# EasyEDA Pro project 赛博沙漏彩砂版二代（完全开源）.eprj, board YW_002C_RGB
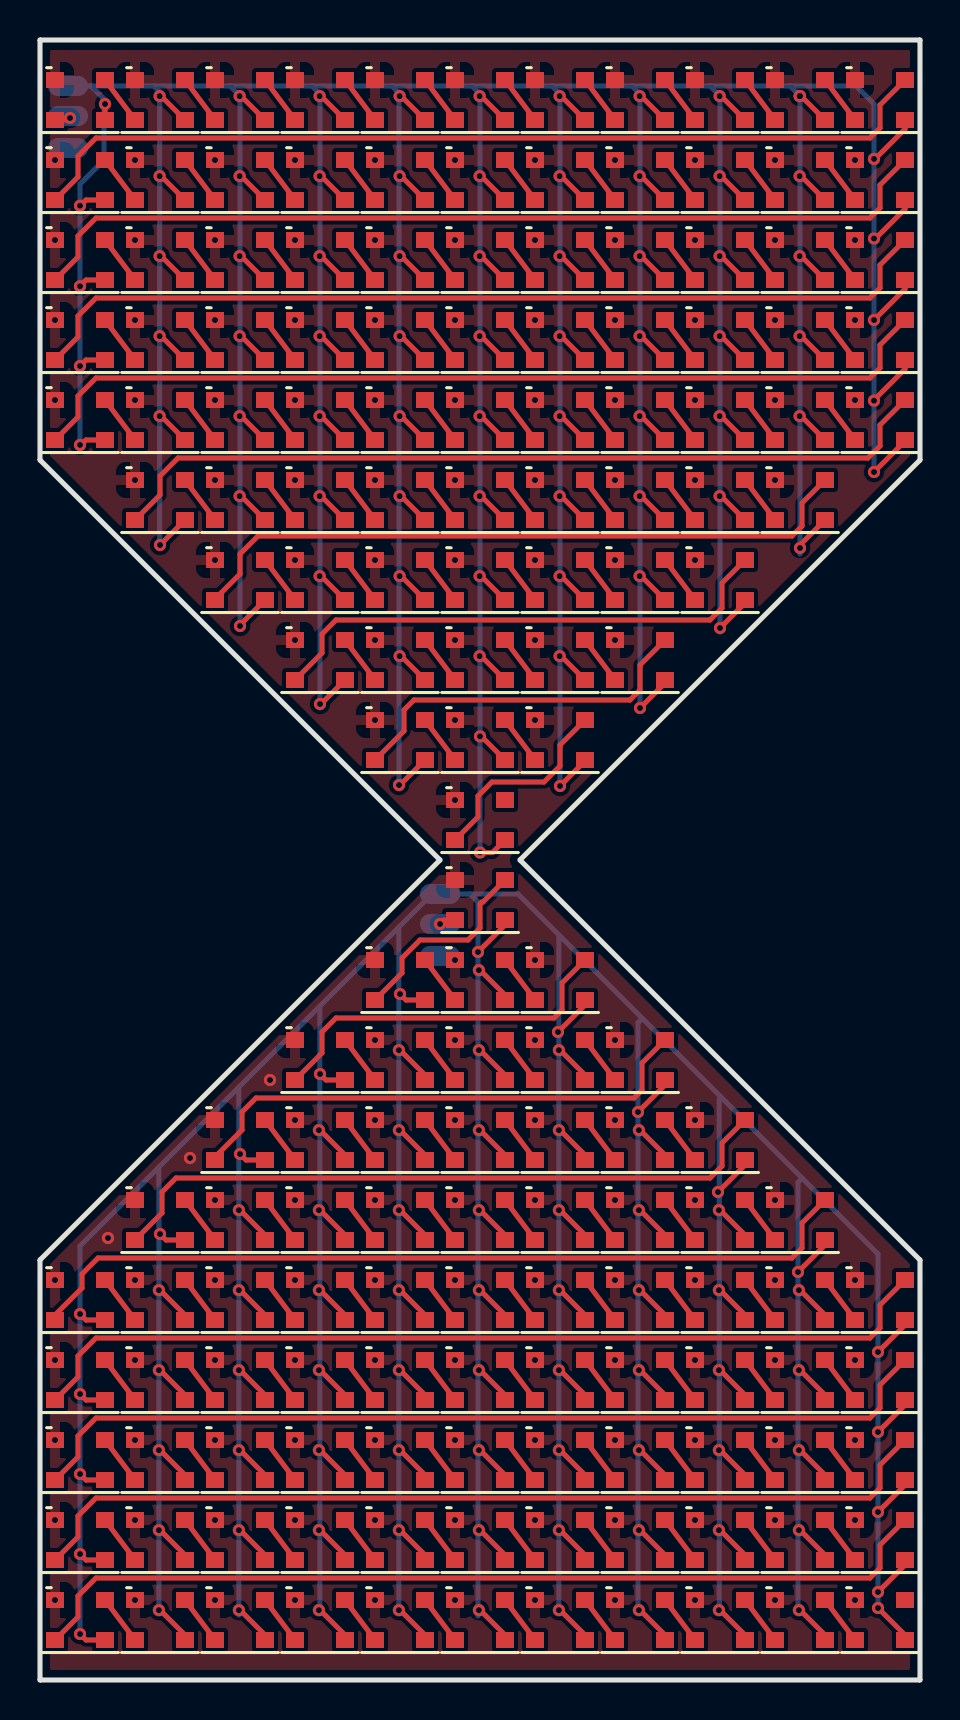
[diagram p4: board, top side]
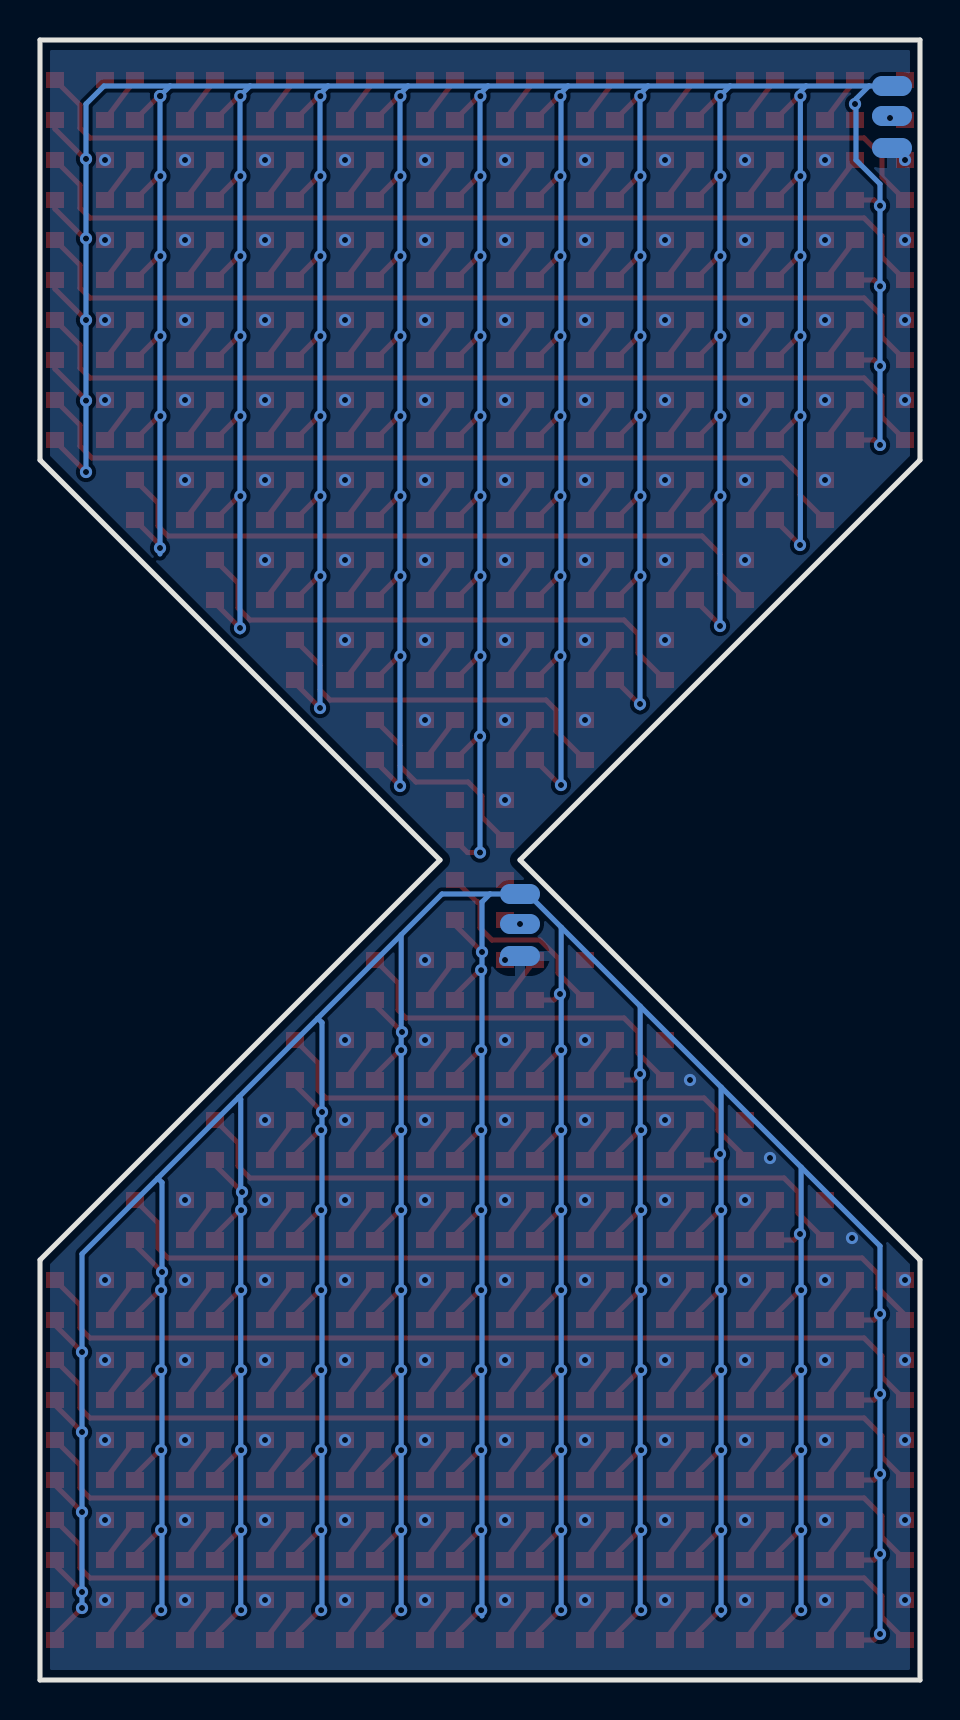
[diagram p5: board, bottom side, seen from below]

Outline 44 x 82 mm; copper layers: Top Layer, Bottom Layer. Coordinates in mm from the lower left corner of the outline.
Outline path: 0,82 0,61 20,41 0,21 0,0 44,0 44,21 24,41 44,61 44,82 0,82
Stack: Top Layer 0.035mm / Dielectric1 1.51mm FR4 er 4.5 / Bottom Layer 0.035mm

## Design rules (mm)
template: JLCPCB Capability(Two Layers Board)
spacing copperThickness1oz (default): track to track 0.102, other pairs 0.152 to 0.3
spacing copperThickness2oz: track to track 0.203, other pairs 0.152 to 0.3
track width copperThickness1oz (default): min 0.127, default 0.254, max 2.54
track width copperThickness2oz: min 0.203, default 0.254, max 2.54
differential pair differentialPair (default): width min 0.127, default 0.254, max 2.54; gap min 0.152, default 0.152
via viaSize (default): diameter min 0.5, default 0.61, max 10; hole min 0.3, default 0.305, max 6.3

## Placement (name value [footprint] x y rotation side)
NOREF  -  [Pad_e1321]  20 36.2 0 top
NOREF#2  -  [Pad_e1320]  20 39.3 0 top
NOREF#3  -  [Pad_e1322]  20 37.8 0 top
NOREF#4  -  [Pad_e23]  1.4 78.2 0 top
NOREF#5  -  [Pad_e24]  1.4 79.7 0 top
NOREF#6  -  [Pad_e22]  1.4 76.6 0 top
NOREF#7  -  [WS2812B_3030]  30 75 180 top
NOREF#8  -  [WS2812B_3030]  26 67 180 top
NOREF#9  -  [WS2812B_3030]  2 79 180 top
NOREF#10  -  [WS2812B_3030]  6 79 180 top
NOREF#11  -  [WS2812B_3030]  10 79 180 top
NOREF#12  -  [WS2812B_3030]  14 79 180 top
NOREF#13  -  [WS2812B_3030]  18 79 180 top
NOREF#14  -  [WS2812B_3030]  22 79 180 top
NOREF#15  -  [WS2812B_3030]  26 79 180 top
NOREF#16  -  [WS2812B_3030]  30 79 180 top
NOREF#17  -  [WS2812B_3030]  34 79 180 top
NOREF#18  -  [WS2812B_3030]  38 79 180 top
NOREF#19  -  [WS2812B_3030]  42 79 180 top
NOREF#20  -  [WS2812B_3030]  2 75 180 top
NOREF#21  -  [WS2812B_3030]  6 75 180 top
NOREF#22  -  [WS2812B_3030]  10 75 180 top
NOREF#23  -  [WS2812B_3030]  14 75 180 top
NOREF#24  -  [WS2812B_3030]  18 75 180 top
NOREF#25  -  [WS2812B_3030]  22 75 180 top
NOREF#26  -  [WS2812B_3030]  26 75 180 top
NOREF#27  -  [WS2812B_3030]  34 75 180 top
NOREF#28  -  [WS2812B_3030]  38 75 180 top
NOREF#29  -  [WS2812B_3030]  42 75 180 top
NOREF#30  -  [WS2812B_3030]  2 71 180 top
NOREF#31  -  [WS2812B_3030]  6 71 180 top
NOREF#32  -  [WS2812B_3030]  10 71 180 top
NOREF#33  -  [WS2812B_3030]  14 71 180 top
NOREF#34  -  [WS2812B_3030]  18 71 180 top
NOREF#35  -  [WS2812B_3030]  22 71 180 top
NOREF#36  -  [WS2812B_3030]  26 71 180 top
NOREF#37  -  [WS2812B_3030]  30 71 180 top
NOREF#38  -  [WS2812B_3030]  34 71 180 top
NOREF#39  -  [WS2812B_3030]  38 71 180 top
NOREF#40  -  [WS2812B_3030]  42 71 180 top
NOREF#41  -  [WS2812B_3030]  2 67 180 top
NOREF#42  -  [WS2812B_3030]  6 67 180 top
NOREF#43  -  [WS2812B_3030]  10 67 180 top
NOREF#44  -  [WS2812B_3030]  14 67 180 top
NOREF#45  -  [WS2812B_3030]  18 67 180 top
NOREF#46  -  [WS2812B_3030]  22 67 180 top
NOREF#47  -  [WS2812B_3030]  30 67 180 top
NOREF#48  -  [WS2812B_3030]  34 67 180 top
NOREF#49  -  [WS2812B_3030]  38 67 180 top
NOREF#50  -  [WS2812B_3030]  42 67 180 top
NOREF#51  -  [WS2812B_3030]  2 63 180 top
NOREF#52  -  [WS2812B_3030]  6 63 180 top
NOREF#53  -  [WS2812B_3030]  10 63 180 top
NOREF#54  -  [WS2812B_3030]  14 63 180 top
NOREF#55  -  [WS2812B_3030]  18 63 180 top
NOREF#56  -  [WS2812B_3030]  22 63 180 top
NOREF#57  -  [WS2812B_3030]  26 63 180 top
NOREF#58  -  [WS2812B_3030]  30 63 180 top
NOREF#59  -  [WS2812B_3030]  34 63 180 top
NOREF#60  -  [WS2812B_3030]  38 63 180 top
NOREF#61  -  [WS2812B_3030]  42 63 180 top
NOREF#62  -  [WS2812B_3030]  6 59 180 top
NOREF#63  -  [WS2812B_3030]  10 59 180 top
NOREF#64  -  [WS2812B_3030]  14 59 180 top
NOREF#65  -  [WS2812B_3030]  18 59 180 top
NOREF#66  -  [WS2812B_3030]  22 59 180 top
NOREF#67  -  [WS2812B_3030]  26 59 180 top
NOREF#68  -  [WS2812B_3030]  30 59 180 top
NOREF#69  -  [WS2812B_3030]  34 59 180 top
NOREF#70  -  [WS2812B_3030]  38 59 180 top
NOREF#71  -  [WS2812B_3030]  10 55 180 top
NOREF#72  -  [WS2812B_3030]  14 55 180 top
NOREF#73  -  [WS2812B_3030]  18 55 180 top
NOREF#74  -  [WS2812B_3030]  22 55 180 top
NOREF#75  -  [WS2812B_3030]  26 55 180 top
NOREF#76  -  [WS2812B_3030]  30 55 180 top
NOREF#77  -  [WS2812B_3030]  34 55 180 top
NOREF#78  -  [WS2812B_3030]  14 51 180 top
NOREF#79  -  [WS2812B_3030]  18 51 180 top
NOREF#80  -  [WS2812B_3030]  22 51 180 top
NOREF#81  -  [WS2812B_3030]  26 51 180 top
NOREF#82  -  [WS2812B_3030]  30 51 180 top
NOREF#83  -  [WS2812B_3030]  18 47 180 top
NOREF#84  -  [WS2812B_3030]  22 47 180 top
NOREF#85  -  [WS2812B_3030]  26 47 180 top
NOREF#86  -  [WS2812B_3030]  22 43 180 top
NOREF#87  -  [WS2812B_3030]  22 39 180 top
NOREF#88  -  [WS2812B_3030]  18 35 180 top
NOREF#89  -  [WS2812B_3030]  22 35 180 top
NOREF#90  -  [WS2812B_3030]  26 35 180 top
NOREF#91  -  [WS2812B_3030]  14 31 180 top
NOREF#92  -  [WS2812B_3030]  18 31 180 top
NOREF#93  -  [WS2812B_3030]  22 31 180 top
NOREF#94  -  [WS2812B_3030]  26 31 180 top
NOREF#95  -  [WS2812B_3030]  30 31 180 top
NOREF#96  -  [WS2812B_3030]  10 27 180 top
NOREF#97  -  [WS2812B_3030]  14 27 180 top
NOREF#98  -  [WS2812B_3030]  18 27 180 top
NOREF#99  -  [WS2812B_3030]  22 27 180 top
NOREF#100  -  [WS2812B_3030]  26 27 180 top
NOREF#101  -  [WS2812B_3030]  30 27 180 top
NOREF#102  -  [WS2812B_3030]  34 27 180 top
NOREF#103  -  [WS2812B_3030]  6 23 180 top
NOREF#104  -  [WS2812B_3030]  10 23 180 top
NOREF#105  -  [WS2812B_3030]  14 23 180 top
NOREF#106  -  [WS2812B_3030]  18 23 180 top
NOREF#107  -  [WS2812B_3030]  22 23 180 top
NOREF#108  -  [WS2812B_3030]  26 23 180 top
NOREF#109  -  [WS2812B_3030]  30 23 180 top
NOREF#110  -  [WS2812B_3030]  34 23 180 top
NOREF#111  -  [WS2812B_3030]  38 23 180 top
NOREF#112  -  [WS2812B_3030]  2 19 180 top
NOREF#113  -  [WS2812B_3030]  6 19 180 top
NOREF#114  -  [WS2812B_3030]  10 19 180 top
NOREF#115  -  [WS2812B_3030]  14 19 180 top
NOREF#116  -  [WS2812B_3030]  18 19 180 top
NOREF#117  -  [WS2812B_3030]  22 19 180 top
NOREF#118  -  [WS2812B_3030]  26 19 180 top
NOREF#119  -  [WS2812B_3030]  30 19 180 top
NOREF#120  -  [WS2812B_3030]  34 19 180 top
NOREF#121  -  [WS2812B_3030]  38 19 180 top
NOREF#122  -  [WS2812B_3030]  42 19 180 top
NOREF#123  -  [WS2812B_3030]  2 15 180 top
NOREF#124  -  [WS2812B_3030]  6 15 180 top
NOREF#125  -  [WS2812B_3030]  10 15 180 top
NOREF#126  -  [WS2812B_3030]  14 15 180 top
NOREF#127  -  [WS2812B_3030]  18 15 180 top
NOREF#128  -  [WS2812B_3030]  22 15 180 top
NOREF#129  -  [WS2812B_3030]  26 15 180 top
NOREF#130  -  [WS2812B_3030]  30 15 180 top
NOREF#131  -  [WS2812B_3030]  34 15 180 top
NOREF#132  -  [WS2812B_3030]  38 15 180 top
NOREF#133  -  [WS2812B_3030]  42 15 180 top
NOREF#134  -  [WS2812B_3030]  2 11 180 top
NOREF#135  -  [WS2812B_3030]  6 11 180 top
NOREF#136  -  [WS2812B_3030]  10 11 180 top
NOREF#137  -  [WS2812B_3030]  14 11 180 top
NOREF#138  -  [WS2812B_3030]  18 11 180 top
NOREF#139  -  [WS2812B_3030]  22 11 180 top
NOREF#140  -  [WS2812B_3030]  26 11 180 top
NOREF#141  -  [WS2812B_3030]  30 11 180 top
NOREF#142  -  [WS2812B_3030]  34 11 180 top
NOREF#143  -  [WS2812B_3030]  38 11 180 top
NOREF#144  -  [WS2812B_3030]  42 11 180 top
NOREF#145  -  [WS2812B_3030]  2 7 180 top
NOREF#146  -  [WS2812B_3030]  6 7 180 top
NOREF#147  -  [WS2812B_3030]  10 7 180 top
NOREF#148  -  [WS2812B_3030]  14 7 180 top
NOREF#149  -  [WS2812B_3030]  18 7 180 top
NOREF#150  -  [WS2812B_3030]  22 7 180 top
NOREF#151  -  [WS2812B_3030]  26 7 180 top
NOREF#152  -  [WS2812B_3030]  30 7 180 top
NOREF#153  -  [WS2812B_3030]  34 7 180 top
NOREF#154  -  [WS2812B_3030]  38 7 180 top
NOREF#155  -  [WS2812B_3030]  42 7 180 top
NOREF#156  -  [WS2812B_3030]  2 3 180 top
NOREF#157  -  [WS2812B_3030]  6 3 180 top
NOREF#158  -  [WS2812B_3030]  10 3 180 top
NOREF#159  -  [WS2812B_3030]  14 3 180 top
NOREF#160  -  [WS2812B_3030]  18 3 180 top
NOREF#161  -  [WS2812B_3030]  22 3 180 top
NOREF#162  -  [WS2812B_3030]  26 3 180 top
NOREF#163  -  [WS2812B_3030]  30 3 180 top
NOREF#164  -  [WS2812B_3030]  34 3 180 top
NOREF#165  -  [WS2812B_3030]  38 3 180 top
NOREF#166  -  [WS2812B_3030]  42 3 180 top

## Footprints (pads in the part's own frame, mm; a bottom-side part is the same pattern mirrored in y, then rotated)
Pad_e22
  oval 2x1 smd far side: 5(0,0)
Pad_e23
  oval 2x1 smd far side: 5(0,0)
Pad_e24
  oval 2x1 smd far side: 5(0,0)
Pad_e1320
  oval 2x1 smd far side: 5(0,0)
Pad_e1321
  oval 2x1 smd far side: 5(0,0)
Pad_e1322
  oval 2x1 smd far side: 5(0,0)
WS2812B_3030
  rect 0.9x0.8 smd: 1(-1.25,1) 2(-1.25,-1) 3(1.25,-1) 4(1.25,1)

## Nets
5V: NOREF#2.5 NOREF#5.5 NOREF#7.1 NOREF#8.1 NOREF#9.1 NOREF#10.1 NOREF#11.1 NOREF#12.1 NOREF#13.1 NOREF#14.1 NOREF#15.1 NOREF#16.1 NOREF#17.1 NOREF#18.1 NOREF#19.1 NOREF#20.1 NOREF#21.1 NOREF#22.1 NOREF#23.1 NOREF#24.1 NOREF#25.1 NOREF#26.1 NOREF#27.1 NOREF#28.1 NOREF#29.1 NOREF#30.1 NOREF#31.1 NOREF#32.1 NOREF#33.1 NOREF#34.1 NOREF#35.1 NOREF#36.1 NOREF#37.1 NOREF#38.1 NOREF#39.1 NOREF#40.1 NOREF#41.1 NOREF#42.1 NOREF#43.1 NOREF#44.1 NOREF#45.1 NOREF#46.1 NOREF#47.1 NOREF#48.1 NOREF#49.1 NOREF#50.1 NOREF#51.1 NOREF#52.1 NOREF#53.1 NOREF#54.1 NOREF#55.1 NOREF#56.1 NOREF#57.1 NOREF#58.1 NOREF#59.1 NOREF#60.1 NOREF#61.1 NOREF#62.1 NOREF#63.1 NOREF#64.1 NOREF#65.1 NOREF#66.1 NOREF#67.1 NOREF#68.1 NOREF#69.1 NOREF#70.1 NOREF#71.1 NOREF#72.1 NOREF#73.1 NOREF#74.1 NOREF#75.1 NOREF#76.1 NOREF#77.1 NOREF#78.1 NOREF#79.1 NOREF#80.1 NOREF#81.1 NOREF#82.1 NOREF#83.1 NOREF#84.1 NOREF#85.1 NOREF#86.1 NOREF#87.1 NOREF#88.1 NOREF#89.1 NOREF#90.1 NOREF#91.1 NOREF#92.1 NOREF#93.1 NOREF#94.1 NOREF#95.1 NOREF#96.1 NOREF#97.1 NOREF#98.1 NOREF#99.1 NOREF#100.1 NOREF#101.1 NOREF#102.1 NOREF#103.1 NOREF#104.1 NOREF#105.1 NOREF#106.1 NOREF#107.1 NOREF#108.1 NOREF#109.1 NOREF#110.1 NOREF#111.1 NOREF#112.1 NOREF#113.1 NOREF#114.1 NOREF#115.1 NOREF#116.1 NOREF#117.1 NOREF#118.1 NOREF#119.1 NOREF#120.1 NOREF#121.1 NOREF#122.1 NOREF#123.1 NOREF#124.1 NOREF#125.1 NOREF#126.1 NOREF#127.1 NOREF#128.1 NOREF#129.1 NOREF#130.1 NOREF#131.1 NOREF#132.1 NOREF#133.1 NOREF#134.1 NOREF#135.1 NOREF#136.1 NOREF#137.1 NOREF#138.1 NOREF#139.1 NOREF#140.1 NOREF#141.1 NOREF#142.1 NOREF#143.1 NOREF#144.1 NOREF#145.1 NOREF#146.1 NOREF#147.1 NOREF#148.1 NOREF#149.1 NOREF#150.1 NOREF#151.1 NOREF#152.1 NOREF#153.1 NOREF#154.1 NOREF#155.1 NOREF#156.1 NOREF#157.1 NOREF#158.1 NOREF#159.1 NOREF#160.1 NOREF#161.1 NOREF#162.1 NOREF#163.1 NOREF#164.1 NOREF#165.1 NOREF#166.1
GND: NOREF.5 NOREF#6.5 NOREF#7.3 NOREF#8.3 NOREF#9.3 NOREF#10.3 NOREF#11.3 NOREF#12.3 NOREF#13.3 NOREF#14.3 NOREF#15.3 NOREF#16.3 NOREF#17.3 NOREF#18.3 NOREF#19.3 NOREF#20.3 NOREF#21.3 NOREF#22.3 NOREF#23.3 NOREF#24.3 NOREF#25.3 NOREF#26.3 NOREF#27.3 NOREF#28.3 NOREF#29.3 NOREF#30.3 NOREF#31.3 NOREF#32.3 NOREF#33.3 NOREF#34.3 NOREF#35.3 NOREF#36.3 NOREF#37.3 NOREF#38.3 NOREF#39.3 NOREF#40.3 NOREF#41.3 NOREF#42.3 NOREF#43.3 NOREF#44.3 NOREF#45.3 NOREF#46.3 NOREF#47.3 NOREF#48.3 NOREF#49.3 NOREF#50.3 NOREF#51.3 NOREF#52.3 NOREF#53.3 NOREF#54.3 NOREF#55.3 NOREF#56.3 NOREF#57.3 NOREF#58.3 NOREF#59.3 NOREF#60.3 NOREF#61.3 NOREF#62.3 NOREF#63.3 NOREF#64.3 NOREF#65.3 NOREF#66.3 NOREF#67.3 NOREF#68.3 NOREF#69.3 NOREF#70.3 NOREF#71.3 NOREF#72.3 NOREF#73.3 NOREF#74.3 NOREF#75.3 NOREF#76.3 NOREF#77.3 NOREF#78.3 NOREF#79.3 NOREF#80.3 NOREF#81.3 NOREF#82.3 NOREF#83.3 NOREF#84.3 NOREF#85.3 NOREF#86.3 NOREF#87.3 NOREF#88.3 NOREF#89.3 NOREF#90.3 NOREF#91.3 NOREF#92.3 NOREF#93.3 NOREF#94.3 NOREF#95.3 NOREF#96.3 NOREF#97.3 NOREF#98.3 NOREF#99.3 NOREF#100.3 NOREF#101.3 NOREF#102.3 NOREF#103.3 NOREF#104.3 NOREF#105.3 NOREF#106.3 NOREF#107.3 NOREF#108.3 NOREF#109.3 NOREF#110.3 NOREF#111.3 NOREF#112.3 NOREF#113.3 NOREF#114.3 NOREF#115.3 NOREF#116.3 NOREF#117.3 NOREF#118.3 NOREF#119.3 NOREF#120.3 NOREF#121.3 NOREF#122.3 NOREF#123.3 NOREF#124.3 NOREF#125.3 NOREF#126.3 NOREF#127.3 NOREF#128.3 NOREF#129.3 NOREF#130.3 NOREF#131.3 NOREF#132.3 NOREF#133.3 NOREF#134.3 NOREF#135.3 NOREF#136.3 NOREF#137.3 NOREF#138.3 NOREF#139.3 NOREF#140.3 NOREF#141.3 NOREF#142.3 NOREF#143.3 NOREF#144.3 NOREF#145.3 NOREF#146.3 NOREF#147.3 NOREF#148.3 NOREF#149.3 NOREF#150.3 NOREF#151.3 NOREF#152.3 NOREF#153.3 NOREF#154.3 NOREF#155.3 NOREF#156.3 NOREF#157.3 NOREF#158.3 NOREF#159.3 NOREF#160.3 NOREF#161.3 NOREF#162.3 NOREF#163.3 NOREF#164.3 NOREF#165.3 NOREF#166.3
DIN: NOREF#3.5 NOREF#4.5 NOREF#9.4 NOREF#87.4
$1N3075: NOREF#9.2 NOREF#10.4
$1N3076: NOREF#10.2 NOREF#11.4
$1N3077: NOREF#11.2 NOREF#12.4
$1N3078: NOREF#12.2 NOREF#13.4
$1N3079: NOREF#13.2 NOREF#14.4
$1N3080: NOREF#14.2 NOREF#15.4
$1N3081: NOREF#15.2 NOREF#16.4
$1N3114: NOREF#17.2 NOREF#18.4
$1N3115: NOREF#18.2 NOREF#19.4
$1N3116: NOREF#19.2 NOREF#20.4
$1N3117: NOREF#20.2 NOREF#21.4
$1N3118: NOREF#21.2 NOREF#22.4
$1N3119: NOREF#22.2 NOREF#23.4
$1N3120: NOREF#23.2 NOREF#24.4
$1N3153: NOREF#25.2 NOREF#26.4
$1N3154: NOREF#7.4 NOREF#26.2
$1N3155: NOREF#7.2 NOREF#27.4
$1N3156: NOREF#27.2 NOREF#28.4
$1N3157: NOREF#28.2 NOREF#29.4
$1N3158: NOREF#29.2 NOREF#30.4
$1N3159: NOREF#30.2 NOREF#31.4
$1N3192: NOREF#32.2 NOREF#33.4
$1N3193: NOREF#33.2 NOREF#34.4
$1N3194: NOREF#34.2 NOREF#35.4
$1N3195: NOREF#35.2 NOREF#36.4
$1N3196: NOREF#36.2 NOREF#37.4
$1N3197: NOREF#37.2 NOREF#38.4
$1N3198: NOREF#38.2 NOREF#39.4
$1N3231: NOREF#40.2 NOREF#41.4
$1N3232: NOREF#41.2 NOREF#42.4
$1N3233: NOREF#42.2 NOREF#43.4
$1N3234: NOREF#43.2 NOREF#44.4
$1N3235: NOREF#44.2 NOREF#45.4
$1N3236: NOREF#45.2 NOREF#46.4
$1N3237: NOREF#8.4 NOREF#46.2
$1N3270: NOREF#47.2 NOREF#48.4
$1N3271: NOREF#48.2 NOREF#49.4
$1N3272: NOREF#49.2 NOREF#50.4
$1N3273: NOREF#50.2 NOREF#51.4
$1N3274: NOREF#51.2 NOREF#52.4
$1N3275: NOREF#52.2 NOREF#53.4
$1N3276: NOREF#53.2 NOREF#54.4
$1N3309: NOREF#55.2 NOREF#56.4
$1N3310: NOREF#56.2 NOREF#57.4
$1N3311: NOREF#57.2 NOREF#58.4
$1N3312: NOREF#58.2 NOREF#59.4
$1N3313: NOREF#59.2 NOREF#60.4
$1N3314: NOREF#60.2 NOREF#61.4
$1N3315: NOREF#61.2 NOREF#62.4
$1N3348: NOREF#63.2 NOREF#64.4
$1N3349: NOREF#64.2 NOREF#65.4
$1N3350: NOREF#65.2 NOREF#66.4
$1N3351: NOREF#66.2 NOREF#67.4
$1N3352: NOREF#67.2 NOREF#68.4
$1N3353: NOREF#68.2 NOREF#69.4
$1N3354: NOREF#69.2 NOREF#70.4
$1N3355: NOREF#16.2 NOREF#17.4
$1N3356: NOREF#24.2 NOREF#25.4
$1N3357: NOREF#31.2 NOREF#32.4
$1N3358: NOREF#39.2 NOREF#40.4
$1N3359: NOREF#8.2 NOREF#47.4
$1N3360: NOREF#54.2 NOREF#55.4
$1N3361: NOREF#62.2 NOREF#63.4
$1N7892: NOREF#71.2 NOREF#72.4
$1N7893: NOREF#72.2 NOREF#73.4
$1N7894: NOREF#73.2 NOREF#74.4
$1N7895: NOREF#74.2 NOREF#75.4
$1N7896: NOREF#75.2 NOREF#76.4
$1N7897: NOREF#76.2 NOREF#77.4
$1N7898: NOREF#77.2 NOREF#78.4
$1N7931: NOREF#79.2 NOREF#80.4
$1N7932: NOREF#80.2 NOREF#81.4
$1N7933: NOREF#81.2 NOREF#82.4
$1N7934: NOREF#82.2 NOREF#83.4
$1N7935: NOREF#83.2 NOREF#84.4
$1N7936: NOREF#84.2 NOREF#85.4
$1N7937: NOREF#85.2 NOREF#86.4
$1N7939: NOREF#78.2 NOREF#79.4
$1N12635: NOREF#70.2 NOREF#71.4
$1N18771: NOREF#87.2 NOREF#88.4
$1N18772: NOREF#88.2 NOREF#89.4
$1N18773: NOREF#89.2 NOREF#90.4
$1N18774: NOREF#90.2 NOREF#91.4
$1N18775: NOREF#91.2 NOREF#92.4
$1N18776: NOREF#92.2 NOREF#93.4
$1N18777: NOREF#93.2 NOREF#94.4
$1N18810: NOREF#95.2 NOREF#96.4
$1N18811: NOREF#96.2 NOREF#97.4
$1N18812: NOREF#97.2 NOREF#98.4
$1N18813: NOREF#98.2 NOREF#99.4
$1N18814: NOREF#99.2 NOREF#100.4
$1N18815: NOREF#100.2 NOREF#101.4
$1N18816: NOREF#101.2 NOREF#102.4
$1N18849: NOREF#103.2 NOREF#104.4
$1N18850: NOREF#104.2 NOREF#105.4
$1N18851: NOREF#105.2 NOREF#106.4
$1N18852: NOREF#106.2 NOREF#107.4
$1N18853: NOREF#107.2 NOREF#108.4
$1N18854: NOREF#108.2 NOREF#109.4
$1N18855: NOREF#109.2 NOREF#110.4
$1N18888: NOREF#111.2 NOREF#112.4
$1N18889: NOREF#112.2 NOREF#113.4
$1N18890: NOREF#113.2 NOREF#114.4
$1N18891: NOREF#114.2 NOREF#115.4
$1N18892: NOREF#115.2 NOREF#116.4
$1N18893: NOREF#116.2 NOREF#117.4
$1N18894: NOREF#117.2 NOREF#118.4
$1N18927: NOREF#119.2 NOREF#120.4
$1N18928: NOREF#120.2 NOREF#121.4
$1N18929: NOREF#121.2 NOREF#122.4
$1N18930: NOREF#122.2 NOREF#123.4
$1N18931: NOREF#123.2 NOREF#124.4
$1N18932: NOREF#124.2 NOREF#125.4
$1N18933: NOREF#125.2 NOREF#126.4
$1N18966: NOREF#127.2 NOREF#128.4
$1N18967: NOREF#128.2 NOREF#129.4
$1N18968: NOREF#129.2 NOREF#130.4
$1N18969: NOREF#130.2 NOREF#131.4
$1N18970: NOREF#131.2 NOREF#132.4
$1N18972: NOREF#132.2 NOREF#133.4
$1N18973: NOREF#133.2 NOREF#134.4
$1N19006: NOREF#135.2 NOREF#136.4
$1N19007: NOREF#136.2 NOREF#137.4
$1N19008: NOREF#137.2 NOREF#138.4
$1N19009: NOREF#138.2 NOREF#139.4
$1N19010: NOREF#139.2 NOREF#140.4
$1N19012: NOREF#140.2 NOREF#141.4
$1N19013: NOREF#141.2 NOREF#142.4
$1N19044: NOREF#143.2 NOREF#144.4
$1N19045: NOREF#144.2 NOREF#145.4
$1N19046: NOREF#145.2 NOREF#146.4
$1N19047: NOREF#146.2 NOREF#147.4
$1N19048: NOREF#147.2 NOREF#148.4
$1N19050: NOREF#148.2 NOREF#149.4
$1N19051: NOREF#149.2 NOREF#150.4
$1N19052: NOREF#94.2 NOREF#95.4
$1N19053: NOREF#102.2 NOREF#103.4
$1N19054: NOREF#110.2 NOREF#111.4
$1N19055: NOREF#118.2 NOREF#119.4
$1N19056: NOREF#126.2 NOREF#127.4
$1N19057: NOREF#134.2 NOREF#135.4
$1N19058: NOREF#142.2 NOREF#143.4
$1N19093: NOREF#151.2 NOREF#152.4
$1N19094: NOREF#152.2 NOREF#153.4
$1N19095: NOREF#153.2 NOREF#154.4
$1N19096: NOREF#154.2 NOREF#155.4
$1N19097: NOREF#155.2 NOREF#156.4
$1N19098: NOREF#156.2 NOREF#157.4
$1N19099: NOREF#157.2 NOREF#158.4
$1N19132: NOREF#159.2 NOREF#160.4
$1N19133: NOREF#160.2 NOREF#161.4
$1N19134: NOREF#161.2 NOREF#162.4
$1N19135: NOREF#162.2 NOREF#163.4
$1N19136: NOREF#163.2 NOREF#164.4
$1N19137: NOREF#164.2 NOREF#165.4
$1N19138: NOREF#165.2 NOREF#166.4
$1N19139: NOREF#158.2 NOREF#159.4
$1N19142: NOREF#150.2 NOREF#151.4

Pads without a net: NOREF#86 2; NOREF#166 2

## Via types
v1: diameter 0.61, hole 0.305, Top Layer to Bottom Layer, 310 vias

## Routing (per net, layer and track width the routed paths; a pad name or vN(x,y) marks a point on that pad's centre or on a via; arc(x,y) is an arc through that point)
5V: length 1002.9
  Top Layer w0.254: v1(41.9,3.6) 43.25,2.25 NOREF#166.1 ; NOREF#153.1 35.25,6.25 34,7.5 ; NOREF#104.1 11.25,22.25 10,23.5 ; NOREF#105.1 15.25,22.25 14,23.5 ; NOREF#132.1 39.25,14.25 38,15.5 ; NOREF#125.1 11.25,14.25 10,15.5 ; v1(25.9,32.4) 27.25,33.75 NOREF#90.1 ; NOREF#54.1 14,63.25 ; 18,23.5 19.25,22.25 NOREF#106.1 ; 41.7,64 43.25,65.55 NOREF#50.1 ; NOREF#45.1 18,67.25 ; v1(2,10.3) 2.3,10 NOREF#134.1 ; NOREF#162.1 27.25,2.25 26,3.5 ; NOREF#117.1 23.25,18.25 22,19.5 ; NOREF#86.1 22.62,41.37 v1(22,41.37) ; NOREF#157.1 7.25,2.25 6,3.5 ; 14,15.5 15.25,14.25 NOREF#126.1 ; 30,3.5 31.25,2.25 NOREF#163.1 ; NOREF#97.1 15.25,26.25 14,27.5 ; 18,27.5 19.25,26.25 NOREF#98.1 ; NOREF#49.1 38,67.25 ; NOREF#161.1 23.25,2.25 22,3.5 ; NOREF#111.1 39.25,21.75 v1(37.9,20.4) ; NOREF#39.1 38,71.25 ; NOREF#152.1 31.25,6.25 30,7.5 ; NOREF#7.1 30,75.25 ; NOREF#84.1 22,47.25 ; 18,19.5 19.25,18.25 NOREF#116.1 ; NOREF#43.1 10,67.25 ; NOREF#154.1 39.25,6.25 38,7.5 ; 26,23.5 27.25,22.25 NOREF#108.1 ; v1(6,22.3) 6.3,22 NOREF#103.1 ; NOREF#133.1 43.25,13.75 v1(41.9,12.4) ; NOREF#100.1 27.25,26.25 26,27.5 ; NOREF#28.1 38,75.25 ; 30,15.5 31.25,14.25 NOREF#130.1 ; NOREF#112.1 2.3,18 v1(2,18.3) ; NOREF#110.1 35.25,22.25 34,23.5 ; v1(41.9,4.4) 43.25,5.75 NOREF#155.1 ; NOREF#119.1 31.25,18.25 30,19.5 ; NOREF#141.1 31.25,10.25 30,11.5 ; NOREF#10.1 6,79.25 ; NOREF#59.1 34,63.25 ; NOREF#27.1 34,75.25 ; 22,31.5 23.25,30.25 NOREF#93.1 ; 30,27.5 31.25,26.25 NOREF#101.1 ; NOREF#118.1 27.25,18.25 26,19.5 ; NOREF#127.1 19.25,14.25 18,15.5 ; 17.9,44.7 17.95,44.7 NOREF#83.1 ; NOREF#92.1 19.25,30.25 18,31.5 ; 2,61.7 2.3,62 NOREF#51.1 ; NOREF#66.1 22,59.25 ; NOREF#65.1 18,59.25 ; NOREF#79.1 18,51.25 ; 26,31.5 27.25,30.25 NOREF#94.1 ; NOREF#121.1 39.25,18.25 38,19.5 ; NOREF#31.1 6,71.25 ; NOREF#52.1 6,63.25 ; NOREF#149.1 19.25,6.25 18,7.5 ; 6,7.5 7.25,6.25 NOREF#146.1 ; 14,19.5 15.25,18.25 NOREF#115.1 ; NOREF#91.1 14.3,30 v1(14,30.3) ; NOREF#24.1 18,75.25 ; NOREF#139.1 23.25,10.25 22,11.5 ; 22,15.5 23.25,14.25 NOREF#128.1 ; 2,73.7 2.3,74 NOREF#20.1 ; NOREF#67.1 26,59.25 ; NOREF#48.1 34,67.25 ; 41.7,72 43.25,73.55 NOREF#29.1 ; v1(2,6.3) 2.3,6 NOREF#145.1 ; NOREF#30.1 2.3,70 2,69.7 ; NOREF#41.1 2.3,66 v1(2,65.7) ; NOREF#55.1 18,63.25 ; NOREF#9.1 v1(3.25,78.8) ; 34,3.5 35.25,2.25 NOREF#164.1 ; v1(29.9,28.4) 31.25,29.75 NOREF#95.1 ; NOREF#12.1 14,79.25 ; 22,27.5 23.25,26.25 NOREF#99.1 ; NOREF#124.1 7.25,14.25 6,15.5 ; v1(2,14.3) 2.3,14 NOREF#123.1 ; NOREF#72.1 14,55.25 ; NOREF#46.1 22,67.25 ; NOREF#23.1 14,75.25 ; NOREF#47.1 30,67.25 ; NOREF#144.1 43.25,9.75 v1(41.9,8.4) ; v1(41.9,16.4) 43.25,17.75 NOREF#122.1 ; 14,48.7 14,48.75 NOREF#78.1 ; NOREF#57.1 26,63.25 ; 18,11.5 19.25,10.25 NOREF#138.1 ; NOREF#22.1 10,75.25 ; 6,19.5 7.25,18.25 NOREF#113.1 ; NOREF#81.1 26,51.25 ; NOREF#159.1 15.25,2.25 14,3.5 ; NOREF#73.1 18,55.25 ; 26,15.5 27.25,14.25 NOREF#129.1 ; NOREF#87.1 23.25,37.75 v1(21.9,36.4) ; NOREF#96.1 10.3,26 v1(10,26.3) ; NOREF#71.1 10,52.75 v1(10,52.7) ; 22,7.5 23.25,6.25 NOREF#150.1 ; NOREF#137.1 15.25,10.25 14,11.5 ; NOREF#160.1 19.25,2.25 18,3.5 ; NOREF#34.1 18,71.25 ; NOREF#17.1 34,79.25 ; NOREF#61.1 43.25,61.95 v1(41.7,60.4) ; 41.7,76 43.25,77.55 NOREF#19.1 ; 26,11.5 27.25,10.25 NOREF#140.1 ; v1(18,34.3) 18.3,34 NOREF#88.1 ; 34,15.5 35.25,14.25 NOREF#131.1 ; NOREF#25.1 22,75.25 ; 38,11.5 39.25,10.25 NOREF#143.1 ; NOREF#18.1 38,79.25 ; v1(34,52.6) 35.25,53.85 NOREF#77.1 ; NOREF#36.1 26,71.25 ; 10,7.5 11.25,6.25 NOREF#147.1 ; NOREF#158.1 11.25,2.25 10,3.5 ; v1(33.9,24.4) 35.25,25.75 NOREF#102.1 ; NOREF#107.1 23.25,22.25 22,23.5 ; NOREF#56.1 22,63.25 ; NOREF#136.1 11.25,10.25 10,11.5 ; NOREF#26.1 26,75.25 ; 30,23.5 31.25,22.25 NOREF#109.1 ; NOREF#15.1 26,79.25 ; NOREF#142.1 35.25,10.25 34,11.5 ; NOREF#38.1 34,71.25 ; v1(41.7,68) 43.25,69.55 NOREF#40.1 ; NOREF#11.1 10,79.25 ; NOREF#53.1 10,63.25 ; NOREF#62.1 v1(6,56.75) 6,56.7 ; NOREF#68.1 30,59.25 ; NOREF#63.1 10,59.25 ; NOREF#69.1 34,59.25 ; NOREF#44.1 14,67.25 ; NOREF#114.1 11.25,18.25 10,19.5 ; NOREF#13.1 18,79.25 ; NOREF#74.1 22,55.25 ; NOREF#82.1 31.25,49.85 v1(30,48.6) ; NOREF#8.1 26,67.25 ; v1(26,44.7) 27.25,45.95 NOREF#85.1 ; NOREF#33.1 14,71.25 ; NOREF#148.1 15.25,6.25 14,7.5 ; NOREF#151.1 27.25,6.25 26,7.5 ; 6,11.5 7.25,10.25 NOREF#135.1 ; NOREF#14.1 22,79.25 ; NOREF#165.1 39.25,2.25 38,3.5 ; NOREF#37.1 30,71.25 ; 34,19.5 35.25,18.25 NOREF#120.1 ; NOREF#64.1 14,59.25 ; NOREF#89.1 23.25,34.25 22,35.5 ; NOREF#42.1 6,67.25 ; NOREF#76.1 30,55.25 ; NOREF#35.1 22,71.25 ; v1(2,2.3) 2.3,2 NOREF#156.1 ; NOREF#58.1 30,63.25 ; NOREF#21.1 6,75.25 ; NOREF#70.1 38,56.75 v1(38,56.6) ; NOREF#60.1 38,63.25 ; NOREF#16.1 30,79.25 ; NOREF#80.1 22,51.25 ; NOREF#32.1 10,71.25 ; NOREF#75.1 26,55.25
  Bottom Layer w0.254: 21.5,39.3 NOREF#2.5 19.6,39.3 17.94,37.64 ; 21.5,39.3 23.9,39.3 25.94,37.26 ; 21.5,39.3 21.9,38.9 v1(21.9,36.4) 21.9,3.2 ; 29.6,79.7 30,79.3 v1(30,48.6) ; 29.6,79.7 33.5,79.7 ; 29.6,79.7 25.6,79.7 ; 13.6,79.7 14,79.3 14,48.6 ; 13.6,79.7 9.5,79.7 ; 13.6,79.7 17.6,79.7 ; 33.5,79.7 37.5,79.7 ; 33.5,79.7 34,79.2 34,52.4 ; 37.5,79.7 v1(38,79.2) 38,56.3 ; 37.5,79.7 40.8,79.7 41.7,78.8 v1(41.7,76.05) v1(41.7,72.07) v1(41.7,68) v1(41.7,63.97) v1(41.7,60.4) ; 34.06,29.14 30.12,33.08 ; 34.06,29.14 38.11,25.09 ; 34.06,29.14 33.96,29.04 33.96,3.51 v1(33.94,3.49) ; 30.12,33.08 29.9,32.87 v1(29.9,28.4) 29.9,3.54 v1(29.94,3.49) ; 30.12,33.08 25.94,37.26 ; 9.94,3.24 v1(9.94,7.49) v1(9.94,11.49) v1(9.94,15.49) v1(9.94,19.49) v1(9.94,23.49) 9.94,29.64 ; v1(3.25,78.8) 3.23,78.8 3.2,78.77 ; 5.98,56.7 v1(5.98,63.19) v1(5.98,67.19) v1(5.98,71.19) v1(5.98,75.19) 5.98,79.42 5.7,79.7 ; 38.11,25.09 41.9,21.3 v1(41.9,16.4) v1(41.9,12.4) v1(41.9,8.4) v1(41.9,4.4) v1(41.9,3.6) ; 38.11,25.09 37.9,24.88 v1(37.9,20.4) 37.9,3.54 v1(37.94,3.49) ; v1(26,44.7) 26,79.3 25.6,79.7 ; 3.2,78.77 3.2,76 2,74.8 v1(2,73.71) v1(2,69.69) v1(2,65.7) v1(2,61.75) ; 3.2,78.77 3.2,79.05 2.55,79.7 ; 2.55,79.7 NOREF#5.5 ; 2.55,79.7 5.7,79.7 ; 21.6,79.7 17.6,79.7 ; 21.6,79.7 25.6,79.7 ; 21.6,79.7 22,79.3 v1(22,47.18) v1(22,41.37) ; 17.6,79.7 17.95,79.35 v1(17.95,44.75) ; 5.94,25.64 v1(5.94,19.49) v1(5.94,15.49) v1(5.94,11.49) v1(5.94,7.49) v1(5.94,3.49) ; 5.94,25.64 2,21.7 v1(2,18.3) v1(2,14.3) v1(2,10.3) v1(2,6.3) v1(2,2.3) ; 5.94,25.64 9.94,29.64 ; 13.99,33.69 13.99,3.44 v1(13.94,3.49) ; 13.99,33.69 17.94,37.64 ; 13.99,33.69 9.94,29.64 ; 17.94,37.64 17.94,3.5 v1(17.94,3.49) ; 9.5,79.7 10,79.2 10,52.65 ; 9.5,79.7 5.7,79.7 ; 25.94,37.26 25.94,3.5 v1(25.94,3.49)
  vias: v1(5.98,79.19) v1(9.94,3.49) v1(9.98,79.19) v1(9.98,75.19) v1(9.98,71.19) v1(9.98,67.19) v1(9.98,63.19) v1(9.98,59.19) v1(13.94,27.49) v1(13.94,23.49) v1(13.94,19.49) v1(13.94,15.49) v1(13.94,11.49) v1(13.94,7.49) v1(13.98,79.19) v1(13.98,75.19) v1(13.98,71.19) v1(13.98,67.19) v1(13.98,63.19) v1(13.98,59.19) v1(13.98,55.19) v1(14,48.8) v1(17.94,31.49) v1(17.94,27.49) v1(17.94,23.49) v1(17.94,19.49) v1(17.94,15.49) v1(17.94,11.49) v1(17.94,7.49) v1(17.98,79.19) v1(17.98,75.19) v1(17.98,71.19) v1(17.98,67.19) v1(17.98,63.19) v1(17.98,59.19) v1(17.98,55.19) v1(17.98,51.19) v1(21.94,35.49) v1(21.94,31.49) v1(21.94,27.49) v1(21.94,23.49) v1(21.94,19.49) v1(21.94,15.49) v1(21.94,11.49) v1(21.94,7.49) v1(21.94,3.49) v1(21.98,79.19) v1(21.98,75.19) v1(21.98,71.19) v1(21.98,67.19) v1(21.98,63.19) v1(21.98,59.19) v1(21.98,55.19) v1(21.98,51.19) v1(25.94,31.49) v1(25.94,27.49) v1(25.94,23.49) v1(25.94,19.49) v1(25.94,15.49) v1(25.94,11.49) v1(25.94,7.49) v1(25.98,79.19) v1(25.98,75.19) v1(25.98,71.19) v1(25.98,67.19) v1(25.98,63.19) v1(25.98,59.19) v1(25.98,55.19) v1(25.98,51.19) v1(29.94,27.49) v1(29.94,23.49) v1(29.94,19.49) v1(29.94,15.49) v1(29.94,11.49) v1(29.94,7.49) v1(29.98,79.19) v1(29.98,75.19) v1(29.98,71.19) v1(29.98,67.19) v1(29.98,63.19) v1(29.98,59.19) v1(29.98,55.19) v1(33.94,23.49) v1(33.94,19.49) v1(33.94,15.49) v1(33.94,11.49) v1(33.94,7.49) v1(33.98,79.19) v1(33.98,75.19) v1(33.98,71.19) v1(33.98,67.19) v1(33.98,63.19) v1(33.98,59.19) v1(37.94,19.49) v1(37.94,15.49) v1(37.94,11.49) v1(37.94,7.49) v1(37.98,79.19) v1(37.98,75.19) v1(37.98,71.19) v1(37.98,67.19) v1(37.98,63.19)
GND:
  vias: v1(0.75,76) v1(0.75,72) v1(0.75,68) v1(0.75,64) v1(0.75,20) v1(0.75,16) v1(0.75,12) v1(0.75,8) v1(0.75,4) v1(3.4,22.1) v1(4.75,76) v1(4.75,72) v1(4.75,68) v1(4.75,64) v1(4.75,60) v1(4.75,20) v1(4.75,16) v1(4.75,12) v1(4.75,8) v1(4.75,4) v1(7.5,26.1) v1(8.75,76) v1(8.75,72) v1(8.75,68) v1(8.75,64) v1(8.75,60) v1(8.75,56) v1(8.75,24) v1(8.75,20) v1(8.75,16) v1(8.75,12) v1(8.75,8) v1(8.75,4) v1(11.5,30) v1(12.75,76) v1(12.75,72) v1(12.75,68) v1(12.75,64) v1(12.75,60) v1(12.75,56) v1(12.75,52) v1(12.75,28) v1(12.75,24) v1(12.75,20) v1(12.75,16) v1(12.75,12) v1(12.75,8) v1(12.75,4) v1(16.75,76) v1(16.75,72) v1(16.75,68) v1(16.75,64) v1(16.75,60) v1(16.75,56) v1(16.75,52) v1(16.75,48) v1(16.75,32) v1(16.75,28) v1(16.75,24) v1(16.75,20) v1(16.75,16) v1(16.75,12) v1(16.75,8) v1(16.75,4) v1(20.75,76) v1(20.75,72) v1(20.75,68) v1(20.75,64) v1(20.75,60) v1(20.75,56) v1(20.75,52) v1(20.75,48) v1(20.75,44) v1(20.75,36) v1(20.75,32) v1(20.75,28) v1(20.75,24) v1(20.75,20) v1(20.75,16) v1(20.75,12) v1(20.75,8) v1(20.75,4) v1(24.75,76) v1(24.75,72) v1(24.75,68) v1(24.75,64) v1(24.75,60) v1(24.75,56) v1(24.75,52) v1(24.75,48) v1(24.75,36) v1(24.75,32) v1(24.75,28) v1(24.75,24) v1(24.75,20) v1(24.75,16) v1(24.75,12) v1(24.75,8) v1(24.75,4) v1(28.75,76) v1(28.75,72) v1(28.75,68) v1(28.75,64) v1(28.75,60) v1(28.75,56) v1(28.75,52) v1(28.75,32) v1(28.75,28) v1(28.75,24) v1(28.75,20) v1(28.75,16) v1(28.75,12) v1(28.75,8) v1(28.75,4) v1(32.75,76) v1(32.75,72) v1(32.75,68) v1(32.75,64) v1(32.75,60) v1(32.75,56) v1(32.75,28) v1(32.75,24) v1(32.75,20) v1(32.75,16) v1(32.75,12) v1(32.75,8) v1(32.75,4) v1(36.75,76) v1(36.75,72) v1(36.75,68) v1(36.75,64) v1(36.75,60) v1(36.75,24) v1(36.75,20) v1(36.75,16) v1(36.75,12) v1(36.75,8) v1(36.75,4) v1(40.75,76) v1(40.75,72) v1(40.75,68) v1(40.75,64) v1(40.75,20) v1(40.75,16) v1(40.75,12) v1(40.75,8) v1(40.75,4)
DIN: length 1.8
  Top Layer w0.254: NOREF#87.4 20.2,38 v1(20,37.8) ; NOREF#9.4 1.4,78 v1(1.5,78.1)
  Bottom Layer w0.254: v1(1.5,78.1) NOREF#4.5
$1N3075: length 2.5
  Top Layer w0.254: NOREF#9.2 NOREF#10.4
$1N3076: length 2.5
  Top Layer w0.254: NOREF#10.2 NOREF#11.4
$1N3077: length 2.5
  Top Layer w0.254: NOREF#11.2 NOREF#12.4
$1N3078: length 2.5
  Top Layer w0.254: NOREF#12.2 NOREF#13.4
$1N3079: length 2.5
  Top Layer w0.254: NOREF#13.2 NOREF#14.4
$1N3080: length 2.5
  Top Layer w0.254: NOREF#14.2 NOREF#15.4
$1N3081: length 2.5
  Top Layer w0.254: NOREF#15.2 NOREF#16.4
$1N3114: length 2.5
  Top Layer w0.254: NOREF#17.2 NOREF#18.4
$1N3115: length 2.5
  Top Layer w0.254: NOREF#18.2 NOREF#19.4
$1N3116: length 46.3
  Top Layer w0.254: NOREF#20.4 1.9,75.15 1.9,76.2 2.8,77.1 41.5,77.1 42,77.6 42,78.75 NOREF#19.2
$1N3117: length 2.5
  Top Layer w0.254: NOREF#20.2 NOREF#21.4
$1N3118: length 2.5
  Top Layer w0.254: NOREF#21.2 NOREF#22.4
$1N3119: length 2.5
  Top Layer w0.254: NOREF#22.2 NOREF#23.4
$1N3120: length 2.5
  Top Layer w0.254: NOREF#23.2 NOREF#24.4
$1N3153: length 2.5
  Top Layer w0.254: NOREF#25.2 NOREF#26.4
$1N3154: length 2.5
  Top Layer w0.254: NOREF#26.2 NOREF#7.4
$1N3155: length 2.5
  Top Layer w0.254: NOREF#7.2 NOREF#27.4
$1N3156: length 2.5
  Top Layer w0.254: NOREF#27.2 NOREF#28.4
$1N3157: length 2.5
  Top Layer w0.254: NOREF#28.2 NOREF#29.4
$1N3158: length 46.3
  Top Layer w0.254: NOREF#29.2 42,74.75 42,73.6 41.5,73.1 2.8,73.1 1.9,72.2 1.9,71.15 NOREF#30.4
$1N3159: length 2.5
  Top Layer w0.254: NOREF#30.2 NOREF#31.4
$1N3192: length 2.5
  Top Layer w0.254: NOREF#32.2 NOREF#33.4
$1N3193: length 2.5
  Top Layer w0.254: NOREF#33.2 NOREF#34.4
$1N3194: length 2.5
  Top Layer w0.254: NOREF#34.2 NOREF#35.4
$1N3195: length 2.5
  Top Layer w0.254: NOREF#35.2 NOREF#36.4
$1N3196: length 2.5
  Top Layer w0.254: NOREF#36.2 NOREF#37.4
$1N3197: length 2.5
  Top Layer w0.254: NOREF#37.2 NOREF#38.4
$1N3198: length 2.5
  Top Layer w0.254: NOREF#38.2 NOREF#39.4
$1N3231: length 46.3
  Top Layer w0.254: NOREF#40.2 42,70.75 42,69.6 41.5,69.1 2.8,69.1 1.9,68.2 1.9,67.15 NOREF#41.4
$1N3232: length 2.5
  Top Layer w0.254: NOREF#41.2 NOREF#42.4
$1N3233: length 2.5
  Top Layer w0.254: NOREF#42.2 NOREF#43.4
$1N3234: length 2.5
  Top Layer w0.254: NOREF#43.2 NOREF#44.4
$1N3235: length 2.5
  Top Layer w0.254: NOREF#44.2 NOREF#45.4
$1N3236: length 2.5
  Top Layer w0.254: NOREF#45.2 NOREF#46.4
$1N3237: length 2.5
  Top Layer w0.254: NOREF#46.2 NOREF#8.4
$1N3270: length 2.5
  Top Layer w0.254: NOREF#47.2 NOREF#48.4
$1N3271: length 2.5
  Top Layer w0.254: NOREF#48.2 NOREF#49.4
$1N3272: length 2.5
  Top Layer w0.254: NOREF#49.2 NOREF#50.4
$1N3273: length 46.3
  Top Layer w0.254: NOREF#51.4 1.9,63.15 1.9,64.2 2.8,65.1 41.5,65.1 42,65.6 42,66.75 NOREF#50.2
$1N3274: length 2.5
  Top Layer w0.254: NOREF#51.2 NOREF#52.4
$1N3275: length 2.5
  Top Layer w0.254: NOREF#52.2 NOREF#53.4
$1N3276: length 2.5
  Top Layer w0.254: NOREF#53.2 NOREF#54.4
$1N3309: length 2.5
  Top Layer w0.254: NOREF#55.2 NOREF#56.4
$1N3310: length 2.5
  Top Layer w0.254: NOREF#56.2 NOREF#57.4
$1N3311: length 2.5
  Top Layer w0.254: NOREF#57.2 NOREF#58.4
$1N3312: length 2.5
  Top Layer w0.254: NOREF#58.2 NOREF#59.4
$1N3313: length 2.5
  Top Layer w0.254: NOREF#59.2 NOREF#60.4
$1N3314: length 2.5
  Top Layer w0.254: NOREF#60.2 NOREF#61.4
$1N3315: length 42.2
  Top Layer w0.254: NOREF#61.2 42,62.75 42,61.7 41.4,61.1 6.9,61.1 6,60.2 6,59.25 NOREF#62.4
$1N3348: length 2.5
  Top Layer w0.254: NOREF#63.2 NOREF#64.4
$1N3349: length 2.5
  Top Layer w0.254: NOREF#64.2 NOREF#65.4
$1N3350: length 2.5
  Top Layer w0.254: NOREF#65.2 NOREF#66.4
$1N3351: length 2.5
  Top Layer w0.254: NOREF#66.2 NOREF#67.4
$1N3352: length 2.5
  Top Layer w0.254: NOREF#67.2 NOREF#68.4
$1N3353: length 2.5
  Top Layer w0.254: NOREF#68.2 NOREF#69.4
$1N3354: length 2.5
  Top Layer w0.254: NOREF#69.2 NOREF#70.4
$1N3355: length 2.5
  Top Layer w0.254: NOREF#16.2 NOREF#17.4
$1N3356: length 2.5
  Top Layer w0.254: NOREF#24.2 NOREF#25.4
$1N3357: length 2.5
  Top Layer w0.254: NOREF#31.2 NOREF#32.4
$1N3358: length 2.5
  Top Layer w0.254: NOREF#39.2 NOREF#40.4
$1N3359: length 2.5
  Top Layer w0.254: NOREF#8.2 NOREF#47.4
$1N3360: length 2.5
  Top Layer w0.254: NOREF#54.2 NOREF#55.4
$1N3361: length 2.5
  Top Layer w0.254: NOREF#62.2 NOREF#63.4
$1N7892: length 2.5
  Top Layer w0.254: NOREF#71.2 NOREF#72.4
$1N7893: length 2.5
  Top Layer w0.254: NOREF#72.2 NOREF#73.4
$1N7894: length 2.5
  Top Layer w0.254: NOREF#73.2 NOREF#74.4
$1N7895: length 2.5
  Top Layer w0.254: NOREF#74.2 NOREF#75.4
$1N7896: length 2.5
  Top Layer w0.254: NOREF#75.2 NOREF#76.4
$1N7897: length 2.5
  Top Layer w0.254: NOREF#76.2 NOREF#77.4
$1N7898: length 26.3
  Top Layer w0.254: NOREF#77.2 34.1,54.85 34.1,53.6 33.5,53 14.8,53 14.1,52.3 14.1,51.35 NOREF#78.4
$1N7931: length 2.5
  Top Layer w0.254: NOREF#79.2 NOREF#80.4
$1N7932: length 2.5
  Top Layer w0.254: NOREF#80.2 NOREF#81.4
$1N7933: length 2.5
  Top Layer w0.254: NOREF#81.2 NOREF#82.4
$1N7934: length 18.3
  Top Layer w0.254: NOREF#83.4 18.2,47.45 18.2,48.5 18.7,49 29.5,49 30,49.5 30,50.75 NOREF#82.2
$1N7935: length 2.5
  Top Layer w0.254: NOREF#83.2 NOREF#84.4
$1N7936: length 2.5
  Top Layer w0.254: NOREF#84.2 NOREF#85.4
$1N7937: length 10.2
  Top Layer w0.254: NOREF#86.4 21.9,43.15 21.9,44.2 22.6,44.9 25.2,44.9 26,45.7 26,46.75 NOREF#85.2
$1N7939: length 2.5
  Top Layer w0.254: NOREF#78.2 NOREF#79.4
$1N12635: length 34.3
  Top Layer w0.254: NOREF#71.4 8.75,54.05 10,55.3 10,56.3 10.9,57.2 37.6,57.2 38.1,57.7 38.1,58.85 NOREF#70.2
$1N18771: length 10.1
  Top Layer w0.254: NOREF#88.4 18.1,35.35 18.1,36.1 19,37 21.4,37 22,37.6 22,38.8 22.1,38.9 22.15,38.9 NOREF#87.2
$1N18772: length 2.5
  Top Layer w0.254: NOREF#88.2 NOREF#89.4
$1N18773: length 2.5
  Top Layer w0.254: NOREF#89.2 NOREF#90.4
$1N18774: length 18.4
  Top Layer w0.254: NOREF#91.4 14.1,31.35 14.1,32.4 14.8,33.1 25.7,33.1 26.1,33.5 26.1,34.85 NOREF#90.2
$1N18775: length 2.5
  Top Layer w0.254: NOREF#91.2 NOREF#92.4
$1N18776: length 2.5
  Top Layer w0.254: NOREF#92.2 NOREF#93.4
$1N18777: length 2.5
  Top Layer w0.254: NOREF#93.2 NOREF#94.4
$1N18810: length 26.4
  Top Layer w0.254: NOREF#95.2 30.1,30.85 30.1,29.5 29.7,29.1 10.8,29.1 10.1,28.4 10.1,27.5 8.75,26.15 NOREF#96.4
$1N18811: length 2.5
  Top Layer w0.254: NOREF#96.2 NOREF#97.4
$1N18812: length 2.5
  Top Layer w0.254: NOREF#97.2 NOREF#98.4
$1N18813: length 2.5
  Top Layer w0.254: NOREF#98.2 NOREF#99.4
$1N18814: length 2.5
  Top Layer w0.254: NOREF#99.2 NOREF#100.4
$1N18815: length 2.5
  Top Layer w0.254: NOREF#100.2 NOREF#101.4
$1N18816: length 2.5
  Top Layer w0.254: NOREF#101.2 NOREF#102.4
$1N18849: length 2.5
  Top Layer w0.254: NOREF#103.2 NOREF#104.4
$1N18850: length 2.5
  Top Layer w0.254: NOREF#104.2 NOREF#105.4
$1N18851: length 2.5
  Top Layer w0.254: NOREF#105.2 NOREF#106.4
$1N18852: length 2.5
  Top Layer w0.254: NOREF#106.2 NOREF#107.4
$1N18853: length 2.5
  Top Layer w0.254: NOREF#107.2 NOREF#108.4
$1N18854: length 2.5
  Top Layer w0.254: NOREF#108.2 NOREF#109.4
$1N18855: length 2.5
  Top Layer w0.254: NOREF#109.2 NOREF#110.4
$1N18888: length 42.3
  Top Layer w0.254: NOREF#112.4 0.75,18.25 2.1,19.6 2.1,20.3 2.9,21.1 37.6,21.1 38.1,21.6 38.1,22.85 NOREF#111.2
$1N18889: length 2.5
  Top Layer w0.254: NOREF#112.2 NOREF#113.4
$1N18890: length 2.5
  Top Layer w0.254: NOREF#113.2 NOREF#114.4
$1N18891: length 2.5
  Top Layer w0.254: NOREF#114.2 NOREF#115.4
$1N18892: length 2.5
  Top Layer w0.254: NOREF#115.2 NOREF#116.4
$1N18893: length 2.5
  Top Layer w0.254: NOREF#116.2 NOREF#117.4
$1N18894: length 2.5
  Top Layer w0.254: NOREF#117.2 NOREF#118.4
$1N18927: length 2.5
  Top Layer w0.254: NOREF#119.2 NOREF#120.4
$1N18928: length 2.5
  Top Layer w0.254: NOREF#120.2 NOREF#121.4
$1N18929: length 2.5
  Top Layer w0.254: NOREF#121.2 NOREF#122.4
$1N18930: length 46.3
  Top Layer w0.254: NOREF#122.2 42,18.75 42,17.6 41.5,17.1 2.8,17.1 1.9,16.2 1.9,15.15 NOREF#123.4
$1N18931: length 2.5
  Top Layer w0.254: NOREF#123.2 NOREF#124.4
$1N18932: length 2.5
  Top Layer w0.254: NOREF#124.2 NOREF#125.4
$1N18933: length 2.5
  Top Layer w0.254: NOREF#125.2 NOREF#126.4
$1N18966: length 2.5
  Top Layer w0.254: NOREF#127.2 NOREF#128.4
$1N18967: length 2.5
  Top Layer w0.254: NOREF#128.2 NOREF#129.4
$1N18968: length 2.5
  Top Layer w0.254: NOREF#129.2 NOREF#130.4
$1N18969: length 2.5
  Top Layer w0.254: NOREF#130.2 NOREF#131.4
$1N18970: length 2.5
  Top Layer w0.254: NOREF#131.2 NOREF#132.4
$1N18972: length 2.5
  Top Layer w0.254: NOREF#132.2 NOREF#133.4
$1N18973: length 46.3
  Top Layer w0.254: NOREF#134.4 1.9,11.15 1.9,12.2 2.8,13.1 41.5,13.1 42,13.6 42,14.75 NOREF#133.2
$1N19006: length 2.5
  Top Layer w0.254: NOREF#135.2 NOREF#136.4
$1N19007: length 2.5
  Top Layer w0.254: NOREF#136.2 NOREF#137.4
$1N19008: length 2.5
  Top Layer w0.254: NOREF#137.2 NOREF#138.4
$1N19009: length 2.5
  Top Layer w0.254: NOREF#138.2 NOREF#139.4
$1N19010: length 2.5
  Top Layer w0.254: NOREF#139.2 NOREF#140.4
$1N19012: length 2.5
  Top Layer w0.254: NOREF#140.2 NOREF#141.4
$1N19013: length 2.5
  Top Layer w0.254: NOREF#141.2 NOREF#142.4
$1N19044: length 2.5
  Top Layer w0.254: NOREF#143.2 NOREF#144.4
$1N19045: length 46.3
  Top Layer w0.254: NOREF#145.4 1.9,7.15 1.9,8.2 2.8,9.1 41.5,9.1 42,9.6 42,10.75 NOREF#144.2
$1N19046: length 2.5
  Top Layer w0.254: NOREF#145.2 NOREF#146.4
$1N19047: length 2.5
  Top Layer w0.254: NOREF#146.2 NOREF#147.4
$1N19048: length 2.5
  Top Layer w0.254: NOREF#147.2 NOREF#148.4
$1N19050: length 2.5
  Top Layer w0.254: NOREF#148.2 NOREF#149.4
$1N19051: length 2.5
  Top Layer w0.254: NOREF#149.2 NOREF#150.4
$1N19052: length 2.5
  Top Layer w0.254: NOREF#94.2 NOREF#95.4
$1N19053: length 34.3
  Top Layer w0.254: NOREF#103.4 6.1,23.35 6.1,24.4 6.8,25.1 33.5,25.1 34.1,25.7 34.1,26.85 NOREF#102.2
$1N19054: length 2.5
  Top Layer w0.254: NOREF#110.2 NOREF#111.4
$1N19055: length 2.5
  Top Layer w0.254: NOREF#118.2 NOREF#119.4
$1N19056: length 2.5
  Top Layer w0.254: NOREF#126.2 NOREF#127.4
$1N19057: length 2.5
  Top Layer w0.254: NOREF#134.2 NOREF#135.4
$1N19058: length 2.5
  Top Layer w0.254: NOREF#142.2 NOREF#143.4
$1N19093: length 2.5
  Top Layer w0.254: NOREF#151.2 NOREF#152.4
$1N19094: length 2.5
  Top Layer w0.254: NOREF#152.2 NOREF#153.4
$1N19095: length 2.5
  Top Layer w0.254: NOREF#153.2 NOREF#154.4
$1N19096: length 2.5
  Top Layer w0.254: NOREF#154.2 NOREF#155.4
$1N19097: length 46.3
  Top Layer w0.254: NOREF#156.4 1.9,3.15 1.9,4.2 2.8,5.1 41.5,5.1 42,5.6 42,6.75 NOREF#155.2
$1N19098: length 2.5
  Top Layer w0.254: NOREF#156.2 NOREF#157.4
$1N19099: length 2.5
  Top Layer w0.254: NOREF#157.2 NOREF#158.4
$1N19132: length 2.5
  Top Layer w0.254: NOREF#159.2 NOREF#160.4
$1N19133: length 2.5
  Top Layer w0.254: NOREF#160.2 NOREF#161.4
$1N19134: length 2.5
  Top Layer w0.254: NOREF#161.2 NOREF#162.4
$1N19135: length 2.5
  Top Layer w0.254: NOREF#162.2 NOREF#163.4
$1N19136: length 2.5
  Top Layer w0.254: NOREF#163.2 NOREF#164.4
$1N19137: length 2.5
  Top Layer w0.254: NOREF#164.2 NOREF#165.4
$1N19138: length 2.5
  Top Layer w0.254: NOREF#165.2 NOREF#166.4
$1N19139: length 2.5
  Top Layer w0.254: NOREF#158.2 NOREF#159.4
$1N19142: length 2.5
  Top Layer w0.254: NOREF#150.2 NOREF#151.4

## Copper pours and planes (outline as drawn; the poured copper is in the pictures)
GND on Top Layer: -2.4,82.4 47.2,82.4 47.2,0.1 -2.4,0.1
GND on Bottom Layer: -0.5,82.3 44.75,82.3 44.75,0 -0.5,0
